# Altium schematic sheet Source_VDDP.SchDoc
size A4; SheetNumber: 4; SheetTotal: 8
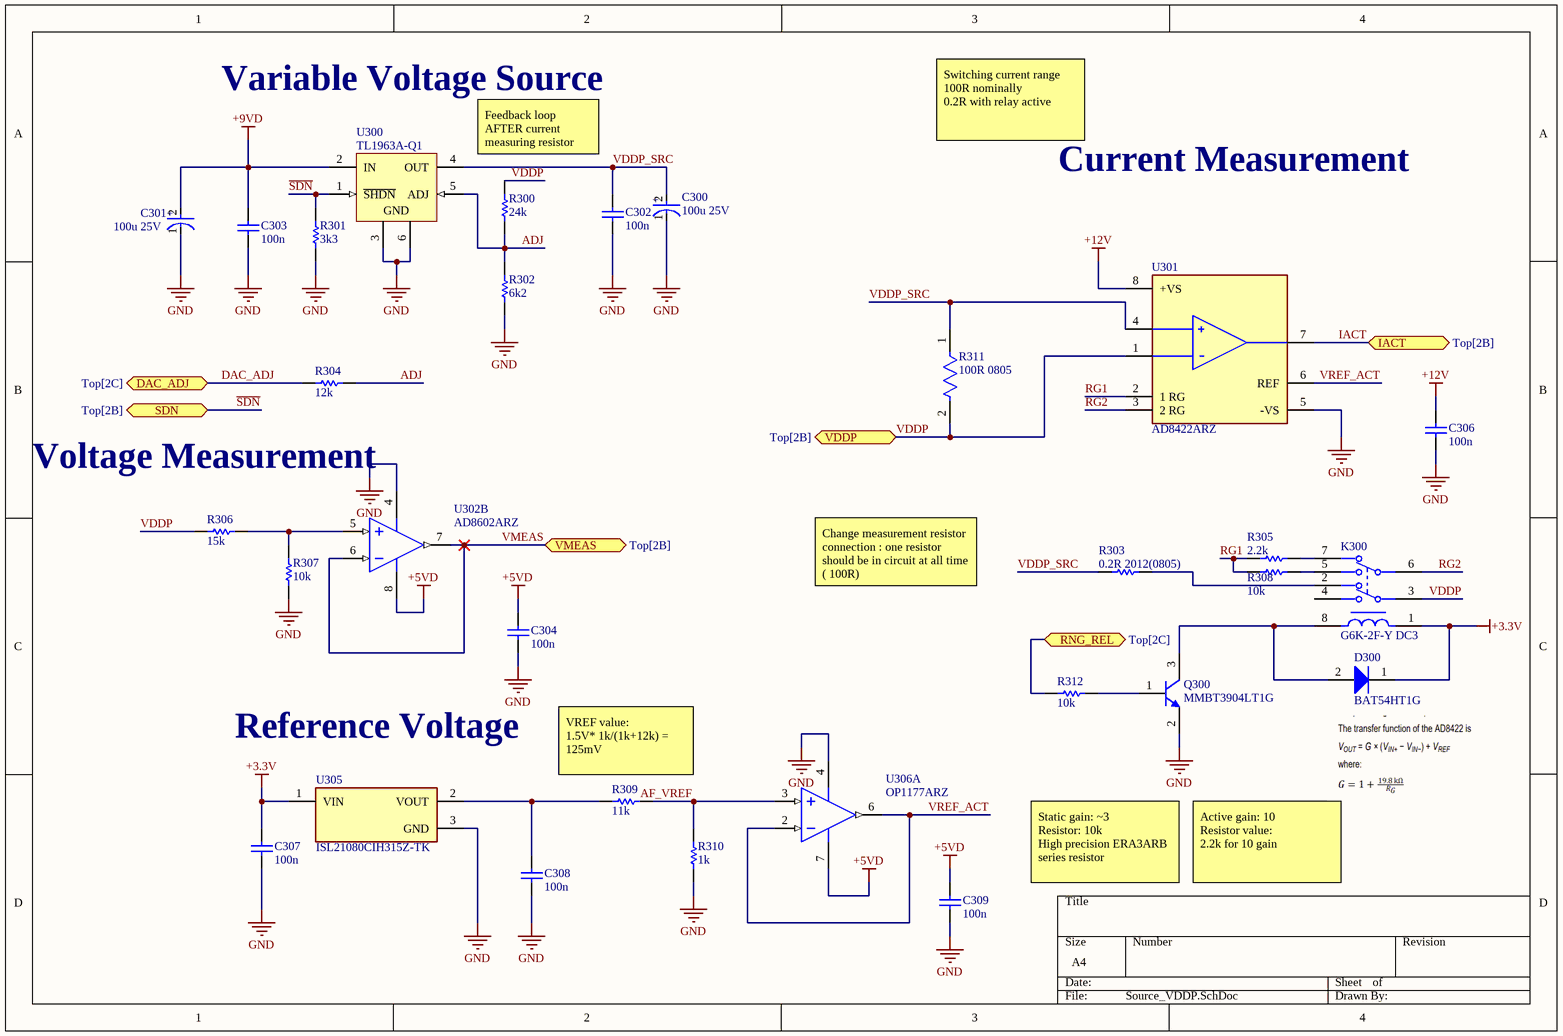
[diagram p0: Source_VDDP.SchDoc]

## Parts
C300  100u 25V  [FP-T491X107K025AT-MFG]
C301  100u 25V  [FP-T491X107K025AT-MFG]
C302  100n  [SAMS-C0603-2_M]
C303  100n  [SAMS-C0603-2_M]
C304  100n  [SAMS-C0603-2_M]
C306  100n  [SAMS-C0603-2_M]
C307  100n  [SAMS-C0603-2_M]
C308  100n  [SAMS-C0603-2_M]
C309  100n  [SAMS-C0603-2_M]
D300  BAT54HT1G  [ONSC-SOD-323-2-477-02_V]
K300  G6K-2F-Y DC3  [FP-G6K-2F-Y_DC3-MFG]
Q300  MMBT3904LT1G  [ONSC-SOT-23-3-318-08_V]
R300  24k  [RESC1608X55X30ML15T15]
R301  3k3  [RESC1609X55X30ML15T15]
R302  6k2  [RESC1608X55X30ML15T15]
R303  0.2R 2012(0805)  [RESC2013X46X38ML25T25]
R304  12k  [RESC1608X55X30ML15T15]
R305  2.2k  [RESC1609X55X30ML15T15]
R306  15k  [RESC1608X55X30ML15T15]
R307  10k  [RESC1608X55X30ML15T15]
R308  10k  [RESC1608X55X30ML15T15]
R309  11k  [RESC1608X55X30ML15T15]
R310  1k  [RESC1608X55X30ML15T15]
R311  100R 0805  [FP-CRCW0805-e3-MFG]
R312  10k  [RESC1608X55X30ML15T15]
U300  TL1963A-Q1  [KTT0005A_M]
U301  AD8422ARZ  [FP-R-8-IPC_A]
U302  AD8602ARZ  [ADI-R-8_N]  (part B of 2)
U305  ISL21080CIH315Z-TK  [FP-P3_064A-IPC_A]
U306  OP1177ARZ  [ADI-R-8_M]  (part A of 2)

## Ports
DAC_ADJ (bidir, see Top[2C]), IACT (bidir, see Top[2B]), RNG_REL (bidir, see Top[2C]), SDN (bidir, see Top[2B]), VDDP (bidir, see Top[2B]), VMEAS (bidir, see Top[2B])

## Nets
+3.3V: C307.2 D300.1(K) K300.1 U305.1(VIN)
+5VD: C304.2 C309.2 U302.8(+V) U306.7(+V)
+9VD: C301.2(A) C303.2 U300.2(IN)
+12V: C306.2 U301.8(+VS)
GND: C300.1(C) C301.1(C) C302.1 C303.1 C304.1 C306.1 C307.1 C308.1 C309.1 Q300.2(E) R301.1 R302.1 R307.1 R310.1 U300.3(GND) U300.6(GND) U301.5(-VS) U302.4(-V) U305.3(GND) U306.4(-V)
~{SDN}: R301.2 U300.1(~{SHDN}) ; port SDN
ADJ: R300.1 R302.2 R304.2 U300.5(ADJ)
AF_VREF: R309.1 R310.2 U306.3(+IN)
DAC_ADJ: R304.1 ; port DAC_ADJ
IACT: U301.7(VOUT) ; port IACT
RG1: R305.1 R308.1 U301.2(1_RG)
RG2: K300.6 U301.3(2_RG)
RNG_REL: R312.2 ; port RNG_REL
VDDP: K300.3 R300.2 R306.1 R311.2 U301.1(-IN) ; port VDDP
VDDP_SRC: C300.2(A) C302.2 R303.2 R311.1 U300.4(OUT) U301.4(+IN)
VMEAS: U302.6(-IN_B) U302.7(OUT_B) ; port VMEAS
VREF_ACT: U301.6(REF) U306.2(-IN) U306.6(OUT)
NetC308_2: C308.2 R309.2 U305.2(VOUT)
NetD300_2: D300.2(A) K300.8 Q300.3(C)
NetK300_2: K300.2 R303.1
NetK300_5: K300.5 R308.2
NetK300_7: K300.7 R305.2
NetQ300_1: Q300.1(B) R312.1
NetR306_2: R306.2 R307.2 U302.5(+IN_B)

Not connected (* = marked no-connect by the designer): K300 4

## Notes on the sheet
- Variable Voltage Source
- Feedback loop AFTER current measuring resistor
- Switching current range
  100R nominally
  0.2R with relay active
- Current Measurement
- Voltage Measurement
- Change measurement resistor connection : one resistor should be in circuit at all time ( 100R)
- Reference Voltage
- (near R309) VREF value:
  1.5V* 1k/(1k+12k) = 125mV
- Static gain: ~3
  Resistor: 10k
  High precision ERA3ARB series resistor
- Active gain: 10
  Resistor value:
  2.2k for 10 gain
- (in symbol CMP-2000-07204-2) +

## Library data of the parts
C300 C301 = CMP-2000-07204-2: CAP TANT 100UF 10% 25V 2917; Leakage Current: 25uA; Ripple Current: 742mA; Polarity: Polar; Dissipation Factor: 8%; Life (Hours): 2000Hour; Dielectric Material: Tantalum; ESR (Equivalent Series Resistance): 300mR; Length: 7.3mm; RoHS Compliant: No; Failure Rate: 0.001%; REACH SVHC: No SVHC; Tolerance: 10%; Mount: Surface Mount; Height - Seated (Max): 0.169inch; Features: General Purpose; Height: 4mm; Package Quantity: 1; Case Code (Metric): 7343; Max Operating Temperature: 125°C; Number of Pins: 2; Radiation Hardening: No; Lead Free: Lead Free; Capacitance: 100uF; Termination: SMD/SMT; Voltage Rating: 25V; Series: T491; Depth: 4.3mm; Construction: Flat; Case/Package: 2917; Min Operating Temperature: -55°C; Voltage Rating (DC): 25V; Width: 4.3mm; Packaging: Tape and Reel; Case Code (Imperial): 2917; Voltage: 25V
C302-C304 C306-C309 = CMP-2000-05332-1: Multi-layer Ceramic Capacitor, -55 to 125 degC, 2-Pin SMD (0603), RoHS, Tape and Reel; Manufacturer: Samsung Electro-Mechanics; Capacitance: 0.1µF; Rated Voltage: 50V; Dielectric: X7R; Tolerance (%): ±10%; Case Size/Dimension: 0603; Datasheet URL: https://datasheet.ciiva.com/29198/456651-da-01-en-vs-kondensator-0605-29198839.pdf; Manufacturer URL: http://www.samsungsem.com/global/index.jsp; Datasheet Version: Nov-10
D300 = CMP-1055-00462-1: Schottky Barrier Diode, 2-Pin SOD-323, Pb-Free, Tape and Reel; Manufacturer: On Semiconductor; Configuration: Single; trr Max (ns): 5; IFSM Max (A): 0.6; ComponentLink3URL: http://www.onsemi.com/pub_link/Collateral/477-02.PDF.1; PackageDescription: 2-Pin SOD, Body 1.7 x 1.25 mm; ComponentLink2URL: http://www.onsemi.cn/pub_link/Collateral/BAT54HT1-D.PDF; ComponentLink3Description: Package Specification; ComponentLink2Description: Datasheet; DatasheetVersion: Rev. 6; PackageReference: SOD-323-2-477-02; RoHS: TRUE; ComponentLink1URL: http://www.onsemi.com/; Packing: Tape and Reel; PartNumber: BAT54HT1G; Mounting Technology: Surface Mount; ComponentLink1Description: Manufacturer URL; PackageVersion: Rev. H, 03/2007
K300 = CMP-08823-000016-1: RELAY TELECOM DPDT 1A 3VDC; Manufacturer: Omron; Coil Power: 100mW; Coil Current: 33mA; Coil Voltage: 3V; Number Of Contacts: 2; Coil Resistance: 91Ω; Standoff Height: 0.3mm; Coil Type: Non-Latching; Current Rating: 2A; Package: 0; Device Class L2: Relays; Throw Configuration: DPDT; Ambient Temperature Range High: +70°C; Device Class L3: Signal Relays; Temperature Range Low: -40°C; Digikey Description: RELAY TELECOM DPDT 1A 3VDC; RoHS: TRUE; Height: 5.4mm; Temperature Range High: +70°C; Lead Free: Yes; Manufacturer Part Number: G6K-2F-Y DC3; Device Class L1: Electromechanical; Octopart: https://octopart.com/g6k-2f-y-dc3-omron-694063; Temperature: -40°C to +70°C; ComponentLink2URL: https://omronfs.omron.com/en_US/ecb/products/pdf/en-g6k.pdf; Automotive: No; Ambient Temperature Range Low: -40°C; Category: Relay; ComponentLink2Description: Datasheet; Switching Current: 1A
Q300 = CMP-1048-00631-1: General Purpose Transistor, NPN Silicon, 3-Pin SOT-23, Pb-Free, Tape and Reel; Manufacturer: On Semiconductor; IC Continuous (A): 0.2; fT Min (MHz): 300; ComponentLink2Description: Datasheet; Polarity: NPN; PackageDescription: 3-Pin Small Outline Transistor, Body 2.92 x 1.3 mm, Pitch 0.95 mm; ComponentLink2URL: http://www.onsemi.cn/pub_link/Collateral/MMBT3904LT1-D.PDF; DatasheetVersion: Rev. 12; Mounting Technology: Surface Mount; PartNumber: MMBT3904LT1G; ComponentLink1URL: http://www.onsemi.com/; ComponentLink3Description: Package Specification; ComponentLink1Description: Manufacturer URL; PackageVersion: Rev. AP, 11/2009; PackageReference: SOT-23-3-318-08; Packing: Tape and Reel; ComponentLink3URL: http://www.onsemi.cn/pub_link/Collateral/318-08.PDF; RoHS: TRUE
R300 = CMP-2000-00362-1: Part Number: ERJ-3EKF2402V; Manufacturer: Panasonic
R301 = CMP-2000-00436-2: Chip Resistors, 3.3 KOhm, +/- 1%, 0.1 W, 0603 (1608 Metric), -55 to 155 degC, RoHS, Tape and Reel; Manufacturer: Panasonic; Max Power Dissipation: 100mW; Voltage Rating: 75V; Temperature Coefficient: 100ppm/degreesC; Datasheet Version: 42095.0; Width: 0.8mm; Mount: SurfaceMount; Radiation Hardening: No; Package URL: http://www.st.com/st-web-ui/static/active/en/resource/technical/document/datasheet/CD00001320.pdf; Depth: 0.8mm; Package Description: 2-Pin Surface Mount Device, Body 1.6 x 0.85 mm; Package Quantity: 1; Contact Plating: Tin; Length: 1.6mm; Max Operating Temperature: 155degC; RoHSCompliant: true; Datasheet URL: https://industrial.panasonic.com/cdbs/www-data/pdf/RDA0000/AOA0000C283.pdf; Height: 0.022inch; Military Standard: Not; Termination: SMD/SMT; Case Code (Metric): 1608; Composition: ThickFilm; Resistance: 3.3KOhm; Packaging: TapeandReel; Min Operating Temperature: -55degC; Case/Package: 0603; Voltage Rating (DC): 75V; Lead Free: LeadFree; Package Reference: 0603; Power Rating: 100mW; Manufacturer URL: http://www.panasonic.com/; Case Code (Imperial): 0603; REACH SVHC: NoSVHC; Number of Terminations: 2; Number of Pins: 2; Tolerance: 1%
R302 = CMP-2000-00594-1: Manufacturer: Panasonic; Part Number: ERJ-3EKF6200V
R303 = CMP-2001-04350-1: Part Number: WSL0805R2000FEA; Manufacturer: Vishay Dale
R304 = CMP-1012-00057-2: Part Number: ERJ-3GEYJ201V; Manufacturer: Panasonic
R305 = CMP-2000-00214-2: Chip Resistor, 1.2 KOhm, +/- 1%, 0.1 W, -55 to 155 degC, 0603 (1608 Metric), RoHS, Tape and Reel; Manufacturer: Panasonic; Max Power Dissipation: 100mW; Voltage Rating (DC): 75V; Temperature Coefficient: 100ppm/degC; Package Description: 2-Pin Surface Mount Device, Body 1.6 x 0.85 mm; Contact Plating: Tin; Number of Pins: 2; Resistance: 1.2KOhm; Length: 1.6mm; Height: 0.022inch; Number of Terminations: 2; Mount: SurfaceMount; Package Reference: 0603; Packaging: TapeandReel; Case Code (Metric): 1608; Datasheet Version: 42095.0; Datasheet URL: https://industrial.panasonic.com/cdbs/www-data/pdf/RDA0000/AOA0000C283.pdf; Depth: 0.8mm; REACH SVHC: NoSVHC; Case/Package: 0603; Min Operating Temperature: -55degC; Composition: ThickFilm; Manufacturer URL: http://www.panasonic.com/; Termination: SMD/SMT; Package Quantity: 1; Case Code (Imperial): 0603; Width: 0.031inch; Power Rating: 100mW; Voltage Rating: 75V; Lead Free: LeadFree; Package URL: http://www.st.com/st-web-ui/static/active/en/resource/technical/document/datasheet/CD00001320.pdf; RoHSCompliant: True; Tolerance: 1%; Military Standard: Not; Max Operating Temperature: 155degC
R306 = CMP-2000-00460-1: Part Number: ERJ-3EKF3602V; Manufacturer: Panasonic
R307 R312 = CMP-1012-00109-2: Part Number: ERJ-3GEYJ303V; Manufacturer: Panasonic
R308 = CMP-1012-00320-3: Chip Resistor, 22 Ohm, +/- 1%, 0.1 W, -55 to 155 degC, 0603 (1608 Metric), RoHS, Tape and Reel; PackageReference: 0603; ComponentLink2URL: http://industrial.panasonic.com/cdbs/www-data/pdf/RDA0000/AOA0000C86.pdf; ComponentLink2Description: Datasheet; PackageDescription: 2-Pin Surface Mount Device, Body 1.6 x 0.85 mm; ComponentLink1URL: http://www.panasonic.com/; ComponentLink1Description: Manufacturer URL; DatasheetVersion: Apr-15
R309 = CMP-2000-00199-1: Part Number: ERJ-3EKF1102V; Manufacturer: Panasonic
R310 = CMP-2000-00180-1: Part Number: ERJ-3EKF1001V; Manufacturer: Panasonic
R311 = CMP-1013-00397-3: RES Thick Film, 100Ω, 1%, 0.125W, 100ppm/°C, 0805; Max Power Dissipation: 125mW; Voltage Rating (DC): 150V; Contact Plating: Tin; Weight: 0.000194oz; Resistance: 100R; Temperature Coefficient: 100ppm/°C; Max Operating Temperature: 155°C; Power Rating: 125mW; Radiation Hardening: No; Length: 2mm; Number of Terminations: 2; Case Code (Metric): 2012; Packaging: Tape and Reel; Min Operating Temperature: -55°C; Depth: 1.25mm; Composition: Thick Film; Case Code (Imperial): 0805; Military Standard: Not; Height: 0.02inch; Case/Package: 0805; Width: 0.049inch; Voltage Rating: 150V; Tolerance: 1%; Package Quantity: 10000; Features: Automotive AEC-Q200; Lead Free: Lead Free
U300 = CMP-0395-00836-2: Single Output Fast Transient Response LDO, 1.5 A, Adjustable 1.21 to 20 V Output, 2.1 to 20 V Input, 5-pin DDPAK (KTT), -40 to 125 degC, Green (RoHS & no Sb/Br); PartNumber: TL1963AKTTR; Manufacturer: Texas Instruments; Vout Adj(Min)(V): 1.21; Vout Adj(Max)(V): 20; Iout(Max)(A): 1.5; SubFamily: Single Channel LDO; Iq(Typ)(mA): 1; Vin(Min)(V): 2.1; Vdo(Typ)(mV): 340; Mounting Technology: Surface Mount; DatasheetVersion: SLVS719F; PackageDescription: 3-Pin Plastic Flange Mount, Body 10.16 x 10.34 mm, Pitch 1.7 mm; ComponentLink2Description: Datasheet; ComponentLink2URL: http://www.ti.com/general/docs/lit/getliterature.tsp?genericPartNumber=TL1963A&fileType=pdf; ComponentLink1URL: http://www.ti.com/; Vin(Max)(V): 20; ComponentLink3URL: http://www.ti.com/litv/pdf/mpsf007e; PackageVersion: 4200577-3/F; ComponentLink3Description: Package Specification; PackageReference: KTT0005A; ComponentLink1Description: Manufacturer URL; Eco-Plan: Green (RoHS & no Sb/Br); Code_JEDEC: TO-263
U301 = CMP-09116-000053-1: IC INST AMP 1 CIRCUIT 8SOIC; Number of Amplifiers: 1; Max Supply Current: 1nA; Max Dual Supply Voltage: 18V; Max Supply Voltage: 3.6V; Input Offset Voltage (Vos): 0.3uV; -3db Bandwidth: 2.2MHz; Min Dual Supply Voltage: 1.8V; Output Current per Channel: 20mA; Slew Rate: 0.8V/µs; Input Bias Current: 500pA; Nominal Supply Current: 300uA; Common Mode Rejection Ratio: 94dB; Mount: Surface Mount; Case/Package: SOIC; Radiation Hardening: No; Number of Circuits: 1; Max Operating Temperature: 85°C; Package Quantity: 98; Number of Pins: 8; Lead Free: Contains Lead; REACH SVHC: No SVHC; Number of Channels: 1; Contact Plating: Tin; Packaging: Rail/Tube; Min Operating Temperature: -40°C; Gain Bandwidth Product: 2.2MHz; Bandwidth: 2.2MHz; Min Supply Voltage: 3.6V; Operating Supply Current: 300uA; Length: 5mm; Width: 4mm; Height: 1.5mm
U302 = CMP-0384-00551-1: Double Channel Wide Bandwidth Operational Amplifier, 8.4 MHz BW, 6 V/us SR, Industrial, 8-pin SOIC (R-8), Tube; Generic Part Number: AD8602; Manufacturer: Analog Devices; Input Offset Voltage: 500uV; V Span Min: 2.7V; Small Signal Bandwidth: 8.4MHz; Automotive Qualified: Yes; Input Bias Current: 200fA; Iq/Amp: 1.2mA; Amplifiers Per Package: 2; Slew Rate: 6V/us; V Span Max: 6V; Code_JEDEC: MS-012-AA; ComponentLink2Description: Datasheet; ComponentLink2URL: http://www.analog.com/static/imported-files/data_sheets/AD8601_8602_8604.pdf; ComponentLink3URL: http://www.analog.com/static/imported-files/packages/PKG_PDF/SOIC_Narrow%20(R)/R_8.pdf; ComponentLink1URL: http://www.analog.com/en/index.html; ComponentLink3Description: Package Specification; PartNumber: AD8602ARZ; Mounting Technology: Surface Mount; PackageReference: R-8; PackageDescription: 8-Pin Standard Small Outline Package, Body 3.9 x 4.9 mm, Pitch 1.27 mm; DatasheetVersion: Rev. G; PackageVersion: 060506-A; ComponentLink1Description: Manufacturer URL
U305 = CMP-13559-000003-1: IC VREF SERIES 0.5% SOT23-3; RoHS Compliant: Yes
U306 = CMP-0384-00637-2: Single Channel Wide Bandwidth Operational Amplifier, 1.3 MHz BW, 700 mV/us SR, Industrial, 8-pin SOIC (R-8), Tube; Manufacturer: Analog Devices; Generic Part Number: OP1177; Input Bias Current: 500pA; Amplifiers Per Package: 1; Input Offset Voltage: 15uV; Iq/Amp: 500uA; V Span Max: 36V; V Span Min: 5V; Small Signal Bandwidth: 1.3MHz; Mounting Technology: Surface Mount; Code_JEDEC: MS-012-AA; ComponentLink4Description: Reference Circuit; ComponentLink3Description: Package Specification; PackageVersion: 060506-A; Slew Rate: 700mV/us; RevisionNote: Reference Circuit URL fixed; ComponentLink3URL: http://www.analog.com/static/imported-files/packages/PKG_PDF/SOIC_Narrow%20(R)/R_8.pdf; DatasheetVersion: Rev. G; PartNumber: OP1177ARZ; ComponentLink1URL: http://www.analog.com/en/index.html; ComponentLink1Description: Manufacturer URL; ComponentLink2URL: http://www.analog.com/static/imported-files/data_sheets/OP1177_2177_4177.pdf; PackageReference: R-8; ComponentLink4URL: http://www.analog.com/en/all-operational-amplifiers-op-amps/operational-amplifiers-op-amps/op1177/products/product.html#product-recommendations; ComponentLink2Description: Datasheet; PackageDescription: 8-Pin Standard Small Outline Package, Body 3.9 x 4.9 mm, Pitch 1.27 mm